# EAGLE design daughterboard (EAGLE 4.16)
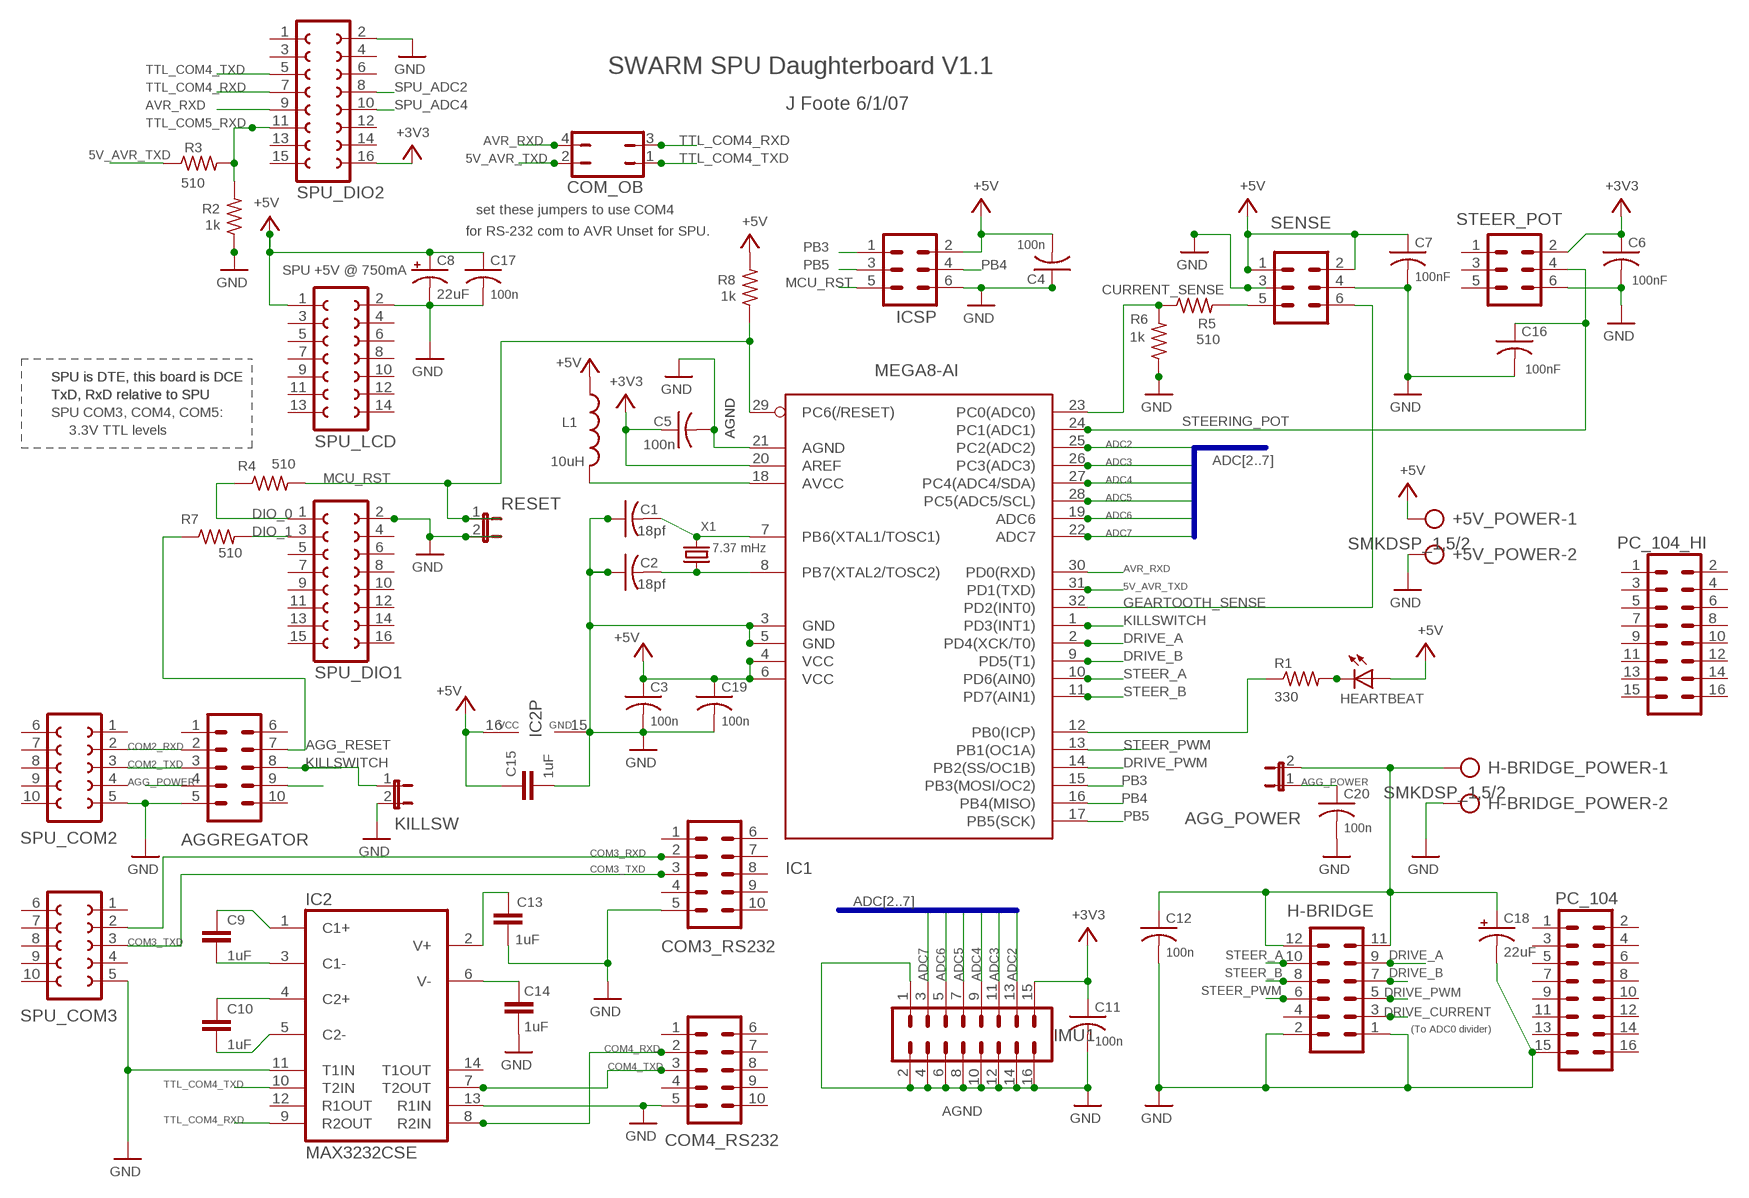
[diagram p0: schematic, sheet 1]

## Parts
+5V_POWER  SMKDSP_1,5/2  [SMKDSP_1,5/2]
AGG_POWER  JP1E  [JP1]
AGGREGATOR  COMHEADER-M  [MA05-2]
C1  18pf  C-USC1206  [C1206]
C2  18pf  C-USC1206  [C1206]
C3  100n  C-USC1206  [C1206]
C4  100n  C-USC1206  [C1206]
C5  100n  C-USC1206  [C1206]
C6  100nF  C-USC1206  [C1206]
C7  100nF  C-USC1206  [C1206]
C8  22uF  CPOL-USCT7343  [CT7343]
C9  1uF  C-EUC1206  [C1206]
C10  1uF  C-EUC1206  [C1206]
C11  100n  C-USC1206  [C1206]
C12  100n  C-USC1206  [C1206]
C13  1uF  C-EUC1206  [C1206]
C14  1uF  C-EUC1206  [C1206]
C15  1uF  C-EUC1206  [C1206]
C16  100nF  C-USC1206  [C1206]
C17  100n  C-USC1206  [C1206]
C18  22uF  CPOL-USCT7343  [CT7343]
C19  100n  C-USC1206  [C1206]
C20  100n  C-USC1206  [C1206]
COM3_RS232  COMHEADER-M  [MA05-2]
COM4_RS232  COMHEADER-M  [MA05-2]
COM_OB  JP2Q  [JP2Q]
H-BRIDGE  MA06-2  [MA06-2]
H-BRIDGE_POWER  SMKDSP_1,5/2  [SMKDSP_1,5/2]
HEARTBEAT  LEDSMT1206  [1206]
IC1  MEGA8-AI  [TQFP32-08]
IC2  MAX3232CSE  [SO16]
ICSP  MA03-2  [MA03-2]
IMU1  MA08-2  [MA08-2]
KILLSW  JP1E  [JP1]
L1  10uH  L-USL5038P  [L5038P]
PC_104  MA08-2  [MA08-2]
PC_104_HI  MA08-2  [MA08-2]
R1  330  R-US_M1206  [M1206]
R2  1k  R-US_M1206  [M1206]
R3  510  R-US_M1206  [M1206]
R4  510  R-US_M1206  [M1206]
R5  510  R-US_M1206  [M1206]
R6  1k  R-US_M1206  [M1206]
R7  510  R-US_M1206  [M1206]
R8  1k  R-US_M1206  [M1206]
RESET  JP1E  [JP1]
SENSE  MA03-2  [MA03-2]
SPU_COM2  COMHEADER  [FE05-2]
SPU_COM3  COMHEADER  [FE05-2]
SPU_DIO1  FE08-2  [FE08-2]
SPU_DIO2  FE08-2  [FE08-2]
SPU_LCD  FE07-2  [FE07-2]
STEER_POT  MA03-2  [MA03-2]
X1  7.37 mHz  CRYSTALHC49UP  [HC49UP]

## Nets
5V_AVR_TXD: COM_OB.2 IC1.31(PD1(TXD)) R3.1
+3V3 [GND]: C5.1 C6.1 C11.1 IC1.20(AREF) IMU1.15 SPU_DIO2.16 STEER_POT.2
+5V: +5V_POWER.1 C3.1 C4.2 C7.1 C8.+ C15.1 C17.1 C19.1 HEARTBEAT.A IC1.4(VCC) IC1.6(VCC) IC2.16(VCC) ICSP.2 L1.1 R8.2 SENSE.1 SENSE.2 SPU_LCD.1
ADC2: IC1.25(PC2(ADC2)) IMU1.13
ADC3: IC1.26(PC3(ADC3)) IMU1.11
ADC4: IC1.27(PC4(ADC4/SDA)) IMU1.9
ADC5: IC1.28(PC5(ADC5/SCL)) IMU1.7
ADC6: IC1.19(ADC6) IMU1.5
ADC7: IC1.22(ADC7) IMU1.3
AGG_POWER: AGG_POWER.1 AGGREGATOR.4 AGGREGATOR.9 C20.1
AGG_RESET: AGGREGATOR.7 R7.1
AVR_RXD: COM_OB.4 IC1.30(PD0(RXD)) SPU_DIO2.9
COM2_RXD: AGGREGATOR.2 SPU_COM2.2
COM2_TXD: AGGREGATOR.3 SPU_COM2.3
COM3_RXD: COM3_RS232.2 SPU_COM3.2
COM3_TXD: COM3_RS232.3 SPU_COM3.3
COM4_RXD: COM4_RS232.2 IC2.8(R2IN)
COM4_TXD: COM4_RS232.3 IC2.7(T2OUT)
CURRENT_SENSE: IC1.23(PC0(ADC0)) R5.1 R6.2
DIO_0: R4.1 SPU_DIO1.1
DIO_1: R7.2 SPU_DIO1.3
DRIVE_A: H-BRIDGE.9 IC1.2(PD4(XCK/T0))
DRIVE_B: H-BRIDGE.7 IC1.9(PD5(T1))
DRIVE_CURRENT: H-BRIDGE.3 R5.2 SENSE.5
DRIVE_PWM: H-BRIDGE.5 IC1.14(PB2(SS/OC1B))
GEARTOOTH_SENSE: IC1.32(PD2(INT0)) SENSE.6
GND [GND]: +5V_POWER.2 AGGREGATOR.5 C1.1 C2.1 C3.2 C4.1 C5.2 C6.2 C7.2 C8.- C11.2 C12.2 C13.2 C14.2 C15.2 C16.2 C17.2 C18.- C19.2 C20.2 COM3_RS232.5 COM4_RS232.5 H-BRIDGE.1 H-BRIDGE.2 H-BRIDGE_POWER.2 IC1.3(GND) IC1.5(GND) IC1.21(AGND) IC2.11(T1IN) IC2.13(R1IN) IC2.15(GND) ICSP.6 IMU1.1 IMU1.2 IMU1.4 IMU1.6 IMU1.8 IMU1.10 IMU1.12 IMU1.14 IMU1.16 KILLSW.2 PC_104.15 R2.1 R6.1 RESET.2 SENSE.3 SENSE.4 SPU_COM2.5 SPU_COM3.5 SPU_DIO1.2 SPU_DIO2.2 SPU_LCD.2 STEER_POT.6
H-BRIDGE_POWER: AGG_POWER.2 C12.1 C18.+ H-BRIDGE.11 H-BRIDGE.12 H-BRIDGE_POWER.1
KILLSWITCH: AGGREGATOR.8 IC1.1(PD3(INT1)) KILLSW.1
MCU_RST: IC1.29(PC6(/RESET)) ICSP.5 R4.2 R8.1 RESET.1
N$1: IC1.12(PB0(ICP)) R1.1
N$3: HEARTBEAT.C R1.2
N$4 [GND]: C1.2 IC1.7(PB6(XTAL1/TOSC1)) X1.2
N$5: IC1.18(AVCC) L1.2
N$7: C14.1 IC2.6(V-)
N$9 [GND]: C2.2 IC1.8(PB7(XTAL2/TOSC2)) X1.1
N$10: C10.1 IC2.4(C2+)
N$11: C13.1 IC2.2(V+)
N$12: C10.2 IC2.5(C2-)
N$13: C9.2 IC2.3(C1-)
N$15: C9.1 IC2.1(C1+)
PB3: IC1.15(PB3(MOSI/OC2)) ICSP.1
PB4: IC1.16(PB4(MISO)) ICSP.4
PB5: IC1.17(PB5(SCK)) ICSP.3
SPU_ADC2: SPU_DIO2.8
SPU_ADC4: SPU_DIO2.10
STEER_A [GND]: H-BRIDGE.10 IC1.10(PD6(AIN0))
STEER_B: H-BRIDGE.8 IC1.11(PD7(AIN1))
STEER_PWM: H-BRIDGE.6 IC1.13(PB1(OC1A))
STEERING_POT: C16.1 IC1.24(PC1(ADC1)) STEER_POT.4
TTL_COM4_RXD: COM_OB.3 IC2.9(R2OUT) SPU_DIO2.7
TTL_COM4_TXD: COM_OB.1 IC2.10(T2IN) SPU_DIO2.5
TTL_COM5_RXD: R2.2 R3.2 SPU_DIO2.11
Unconnected: AGGREGATOR.1 AGGREGATOR.6 AGGREGATOR.10 COM3_RS232.1 COM3_RS232.4 COM3_RS232.6 COM3_RS232.7 COM3_RS232.8 COM3_RS232.9 COM3_RS232.10 COM4_RS232.1 COM4_RS232.4 COM4_RS232.6 COM4_RS232.7 COM4_RS232.8 COM4_RS232.9 COM4_RS232.10 H-BRIDGE.4 IC2.12(R1OUT) IC2.14(T1OUT) PC_104.1 PC_104.2 PC_104.3 PC_104.4 PC_104.5 PC_104.6 PC_104.7 PC_104.8 PC_104.9 PC_104.10 PC_104.11 PC_104.12 PC_104.13 PC_104.14 PC_104.16 PC_104_HI.1 PC_104_HI.2 PC_104_HI.3 PC_104_HI.4 PC_104_HI.5 PC_104_HI.6 PC_104_HI.7 PC_104_HI.8 PC_104_HI.9 PC_104_HI.10 PC_104_HI.11 PC_104_HI.12 PC_104_HI.13 PC_104_HI.14 PC_104_HI.15 PC_104_HI.16 SPU_COM2.1 SPU_COM2.4 SPU_COM2.6 SPU_COM2.7 SPU_COM2.8 SPU_COM2.9 SPU_COM2.10 SPU_COM3.1 SPU_COM3.4 SPU_COM3.6 SPU_COM3.7 SPU_COM3.8 SPU_COM3.9 SPU_COM3.10 SPU_DIO1.4 SPU_DIO1.5 SPU_DIO1.6 SPU_DIO1.7 SPU_DIO1.8 SPU_DIO1.9 SPU_DIO1.10 SPU_DIO1.11 SPU_DIO1.12 SPU_DIO1.13 SPU_DIO1.14 SPU_DIO1.15 SPU_DIO1.16 SPU_DIO2.1 SPU_DIO2.3 SPU_DIO2.4 SPU_DIO2.6 SPU_DIO2.12 SPU_DIO2.13 SPU_DIO2.14 SPU_DIO2.15 SPU_LCD.3 SPU_LCD.4 SPU_LCD.5 SPU_LCD.6 SPU_LCD.7 SPU_LCD.8 SPU_LCD.9 SPU_LCD.10 SPU_LCD.11 SPU_LCD.12 SPU_LCD.13 SPU_LCD.14 STEER_POT.1 STEER_POT.3 STEER_POT.5

## Buses
ADC[2..7]

## Notes on the sheet
- SWARM SPU Daughterboard V1.1
- J Foote 6/1/07
- set these jumpers to use COM4
- for RS-232 com to AVR Unset for SPU.
- SPU +5V @ 750mA
- SPU is DTE, this board is DCE | SPU is DTE, this board is DCE
- TxD, RxD relative to SPU | TxD, RxD relative to SPU | AGND | AGND
- SPU COM3, COM4, COM5:
- 3.3V TTL levels
- (To ADC0 divider)
- AGND

## Library data of the parts
+5V_POWER H-BRIDGE_POWER = con-phoenix-smkdsp:SMKDSP_1,5/2: Printklemme, Nennstrom: 17,5 A, Bemessungsspannung: 250 V, Raster: 5,0 mm Source: http://eshop.phoenixcontact.de .. 1733415.pdf
AGG_POWER KILLSW RESET = jumper:JP1E: JUMPER
AGGREGATOR COM3_RS232 COM4_RS232 = foote:COMHEADER-M
C1-C7 C11 C12 C16 C17 C19 C20 = rcl:C-US: CAPACITOR, American symbol
C8 C18 = rcl:CPOL-US: POLARIZED CAPACITOR, American symbol
C9 C10 C13-C15 = rcl:C-EU: CAPACITOR, European symbol
COM_OB = jumper:JP2Q: JUMPER
H-BRIDGE = con-lstb:MA06-2: PIN HEADER
HEARTBEAT = led:LED: LED OSRAM: - CHIPLED LG R971, LG N971, LY N971, LG Q971, LY Q971, LO R971, LY R971 LH N974, LH R974 LS Q976, LO Q976, LY Q976 LO Q996 - Hyper CHIPLED LW Q18S LB Q993, LB Q99A, LB R99A - SideLED LS A670, LO A670, LY A670, LG A670, LP A670 LB A673, LV A673, LT A673, LW A673 LH A674 LY A675 LS A676, LA A676, LO A676, LY A676, LW A676 LS A679, LY A679, LG A679 - Hyper Micro SIDELED® LS Y876, LA Y876, LO Y876, LY Y876 LT Y87S - SmartLED LW L88C, LW L88S LB L89C, LB L89S, LG L890 LS L89K, LO L89K, LY L89K LS L896, LA L896, LO L896, LY L896 - TOPLED LS T670, LO T670, LY T670, LG T670, LP T670 LSG T670, LSP T670, LSY T670, LOP T670, LYG T670 LG T671, LOG T671, LSG T671 LB T673, LV T673, LT T673, LW T673 LH T674 LS T676, LA T676, LO T676, LY T676, LB T676, LH T676, LSB T676, LW T676 LB T67C, LV T67C, LT T67C, LS T67K, LO T67K, LY T67K, LW E67C LS E67B, LA E67B, LO E67B, LY E67B, LB E67C, LV E67C, LT E67C LW T67C LS T679, LY T679, LG T679 LS T770, LO T770, LY T770, LG T770, LP T770 LB T773, LV T773, LT T773, LW T773 LH T774 LS E675, LA E675, LY E675, LS T675 LS T776, LA T776, LO T776, LY T776, LB T776 LHGB T686 LT T68C, LB T68C - Hyper Mini TOPLED® LB M676 - Mini TOPLED Santana® LG M470 LS M47K, LO M47K, LY M47K Source: http://www.osram.convergy.de - LUMILED® LXK2-PW12-R00, LXK2-PW12-S00, LXK2-PW14-U00, LXK2-PW14-V00 LXK2-PM12-R00, LXK2-PM12-S00, LXK2-PM14-U00 LXK2-PE12-Q00, LXK2-PE12-R00, LXK2-PE12-S00, LXK2-PE14-T00, LXK2-PE14-U00 LXK2-PB12-K00, LXK2-PB12-L00, LXK2-PB12-M00, LXK2-PB14-N00, LXK2-PB14-P00, LXK2-PB14-Q00 LXK2-PR12-L00, LXK2-PR12-M00, LXK2-PR14-Q00, LXK2-PR14-R00 LXK2-PD12-Q00, LXK2-PD12-R00, LXK2-PD12-S00 LXK2-PH12-R00, LXK2-PH12-S00 LXK2-PL12-P00, LXK2-PL12-Q00, LXK2-PL12-R00 Source: www.luxeon.com
IC1 = atmel:MEGA8: MICROCONTROLLER 8 Kbytes FLASH 1 kbytes SRAM 512 bytes EEPROM USART 6-channel 10 bit ADC 2-channel 8 bit ADC Source: avr.lbr
IC2 = maxim:MAX3232*: True RS-232 Transceivers 3.0V to 5.5V, Low-Power up to 1Mbps, Using Four 0.1µF External Capacitors Source: http://pdfserv.maxim-ic.com/en/ds/MAX3222-MAX3241.pdf
ICSP SENSE STEER_POT = con-lstb:MA03-2: PIN HEADER
IMU1 PC_104 PC_104_HI = con-lstb:MA08-2: PIN HEADER
L1 = rcl:L-US: INDUCTOR, American symbol
R1-R8 = rcl:R-US_: RESISTOR, American symbol
SPU_COM2 SPU_COM3 = foote:COMHEADER
SPU_DIO1 SPU_DIO2 = con-lsta:FE08-2: FEMALE HEADER
SPU_LCD = con-lsta:FE07-2: FEMALE HEADER
X1 = crystal:CRYSTAL: CRYSTAL

## Board
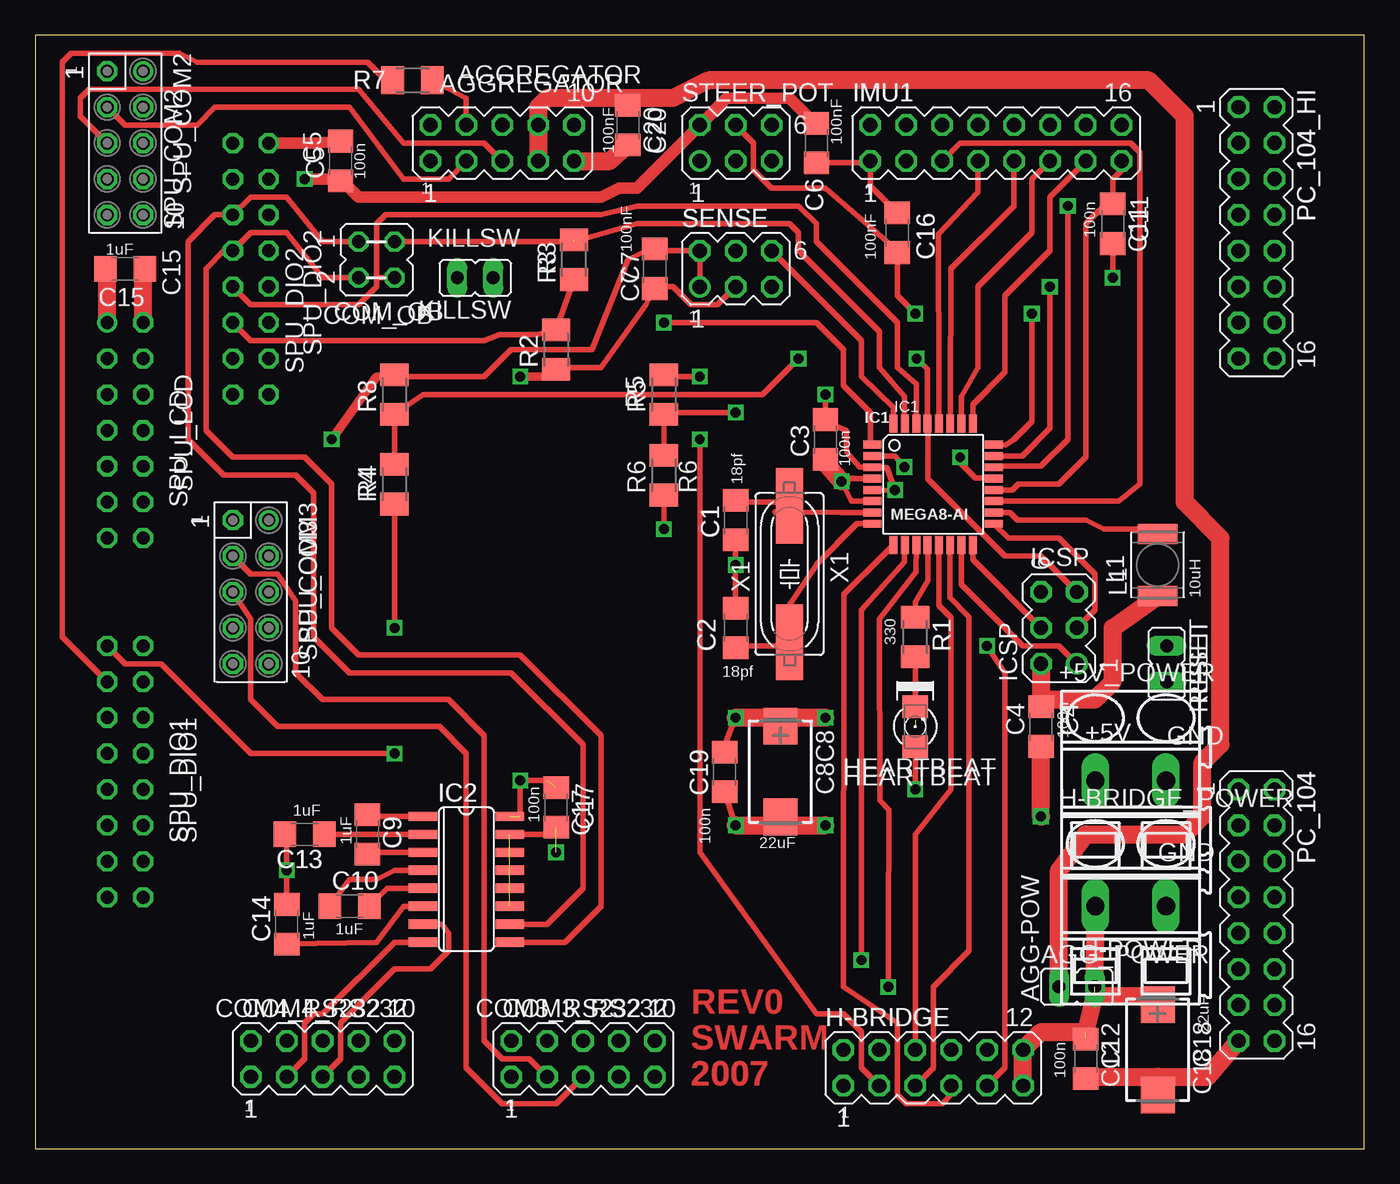
[diagram p1: board, top side]
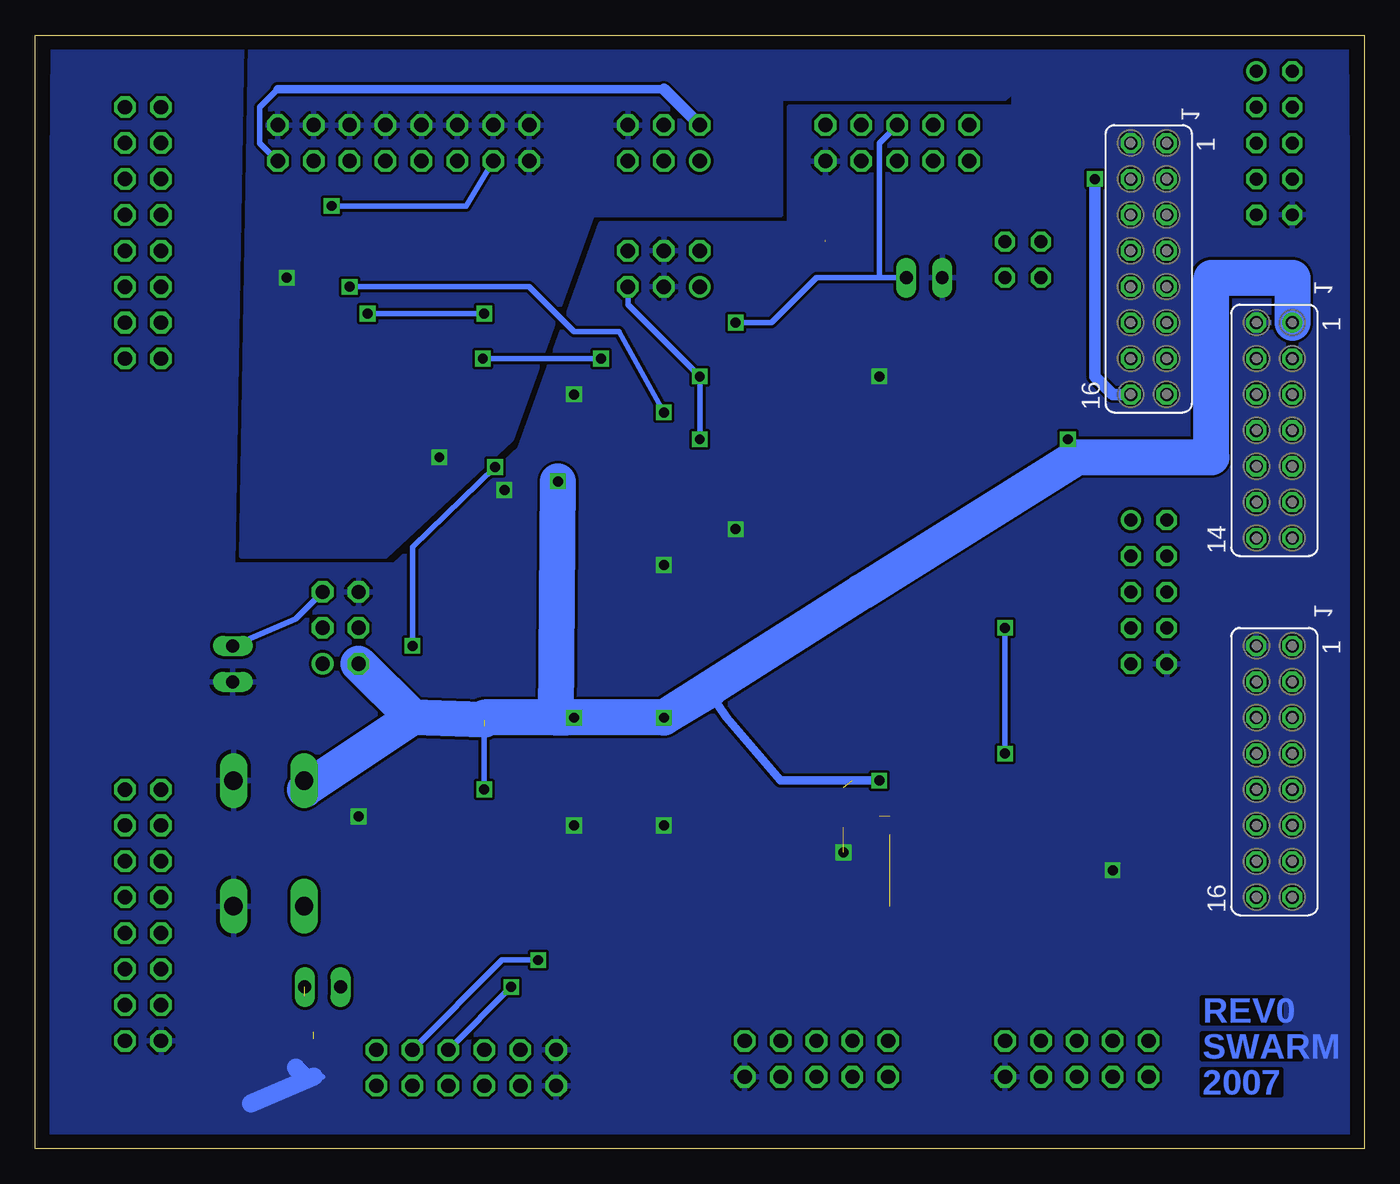
[diagram p2: board, bottom side, seen from below]

Size 93.98 x 78.74 mm. Coordinates in mm from the lower left corner, seen from the top.
Outline: 0,0 93.98,0 93.98,78.74 0,78.74 0,0
Copper layers (1*16): Top 0.035mm / dielectric 1.5mm / Bottom 0.035mm
Design rules "default": minimum track width 10mil, minimum drill 24mil, track to track 8mil, track to pad 8mil, pad to pad 8mil, via to via 8mil, smd to smd 8mil, copper to edge 40mil, drill to drill 8mil, minimum pad ring 10mil, minimum via ring 8mil, stop-mask expansion 4mil, vias tented up to drill 0mil, thermal gap 10mil

### Footprints (pad centres in the part's own frame; a part is rotated, then mirrored left to right if it is on the bottom)
SMKDSP_1,5/2 = drill 1.3 pad 1.676 long: 1 -2.5,0; 2 2.5,0
JP1 = drill 0.914 long: 1 0,-1.27; 2 0,1.27
MA05-2 = drill 1.016 octagon: 1 -5.08,-1.27; 2 -2.54,-1.27; 3 0,-1.27; 4 2.54,-1.27; 5 5.08,-1.27; 6 -5.08,1.27; 7 -2.54,1.27; 8 0,1.27; 9 2.54,1.27; 10 5.08,1.27
C1206 = smd 1.6 x 1.8: 1 -1.4,0; 2 1.4,0
CT7343 = smd 2.6 x 2.4: + 3.2,0; - -3.2,0
JP2Q = drill 0.914 octagon: 1 -1.27,-1.27; 2 -1.27,1.27; 3 1.27,-1.27; 4 1.27,1.27
MA06-2 = drill 1.016 octagon: 1 -6.35,-1.27; 2 -6.35,1.27; 3 -3.81,-1.27; 4 -3.81,1.27; 5 -1.27,-1.27; 6 -1.27,1.27; 7 1.27,-1.27; 8 1.27,1.27; 9 3.81,-1.27; 10 3.81,1.27; 11 6.35,-1.27; 12 6.35,1.27
1206 = smd 1.6 x 1.803: A -1.422,0; C 1.422,0
TQFP32-08 = smd 1.27 x 0.559: 1 -4.293,2.8; 2 -4.293,2; 3 -4.293,1.2; 4 -4.293,0.4; 5 -4.293,-0.4; 6 -4.293,-1.2; 7 -4.293,-2; 8 -4.293,-2.8; 17 4.293,-2.8; 18 4.293,-2; 19 4.293,-1.2; 20 4.293,-0.4; 21 4.293,0.4; 22 4.293,1.2; 23 4.293,2; 24 4.293,2.8 | smd 0.559 x 1.27: 9 -2.8,-4.293; 10 -2,-4.293; 11 -1.2,-4.293; 12 -0.4,-4.293; 13 0.4,-4.293; 14 1.2,-4.293; 15 2,-4.293; 16 2.8,-4.293; 25 2.8,4.293; 26 2,4.293; 27 1.2,4.293; 28 0.4,4.293; 29 -0.4,4.293; 30 -1.2,4.293; 31 -2,4.293; 32 -2.8,4.293
SO16 = smd 0.66 x 2.032: 1 -4.445,-3.073; 2 -3.175,-3.073; 3 -1.905,-3.073; 4 -0.635,-3.073; 5 0.635,-3.073; 6 1.905,-3.073; 7 3.175,-3.073; 8 4.445,-3.073; 9 4.445,3.073; 10 3.175,3.073; 11 1.905,3.073; 12 0.635,3.073; 13 -0.635,3.073; 14 -1.905,3.073; 15 -3.175,3.073; 16 -4.445,3.073
MA03-2 = drill 1.016 round: 1 -2.54,-1.27 | drill 1.016 octagon: 2 -2.54,1.27; 3 0,-1.27; 4 0,1.27; 5 2.54,-1.27; 6 2.54,1.27
MA08-2 = drill 1.016 octagon: 1 -8.89,-1.27; 2 -8.89,1.27; 3 -6.35,-1.27; 4 -6.35,1.27; 5 -3.81,-1.27; 6 -3.81,1.27; 7 -1.27,-1.27; 8 -1.27,1.27; 9 1.27,-1.27; 10 1.27,1.27; 11 3.81,-1.27; 12 3.81,1.27; 13 6.35,-1.27; 14 6.35,1.27; 15 8.89,-1.27; 16 8.89,1.27
L5038P = smd 1.4 x 2.8: 1 -2.2,0; 2 2.2,0
M1206 = smd 1.6 x 2: 1 -1.4,0; 2 1.4,0
FE05-2 = drill 0.914 octagon: 1 -5.08,-1.27; 2 -2.54,-1.27; 3 0,-1.27; 4 2.54,-1.27; 5 5.08,-1.27; 7 -2.54,1.27; 8 0,1.27; 9 2.54,1.27; 10 5.08,1.27 | drill 0.914 round: 6 -5.08,1.27
FE08-2 = drill 0.914 octagon: 1 -8.89,1.27; 2 -8.89,-1.27; 3 -6.35,1.27; 4 -6.35,-1.27; 5 -3.81,1.27; 6 -3.81,-1.27; 7 -1.27,1.27; 8 -1.27,-1.27; 9 1.27,1.27; 10 1.27,-1.27; 11 3.81,1.27; 12 3.81,-1.27; 13 6.35,1.27; 14 6.35,-1.27; 15 8.89,1.27; 16 8.89,-1.27
FE07-2 = drill 0.914 round: 1 -7.62,1.27 | drill 0.914 octagon: 2 -7.62,-1.27; 3 -5.08,1.27; 4 -5.08,-1.27; 5 -2.54,1.27; 6 -2.54,-1.27; 7 0,1.27; 8 0,-1.27; 9 2.54,1.27; 10 2.54,-1.27; 11 5.08,1.27; 12 5.08,-1.27; 13 7.62,1.27; 14 7.62,-1.27
HC49UP = smd 5.334 x 1.93: 1 -4.826,0; 2 4.826,0

### Placement (x,y rotation side)
+5V_POWER  77.47,26.04 0 top
AGG_POWER  73.66,11.43 270 top
AGGREGATOR  33.02,71.12 0 top
C1  49.53,44.45 90 top
C2  49.53,36.83 270 top
C3  55.88,50.16 90 top
C4  71.12,29.84 90 top
C5  21.59,69.85 90 top
C6  55.24,71.12 270 top
C7  43.81,62.23 270 top
C8  52.7,26.67 90 top
C9  23.5,22.23 270 top
C10  22.23,17.14 0 top
C11  76.2,65.41 270 top
C12  74.3,6.35 270 top
C13  19.05,22.23 180 top
C14  17.78,15.88 90 top
C15  6.35,62.23 0 top
C16  60.96,64.77 90 top
C17  36.83,24.13 270 top
C18  79.38,6.99 90 top
C19  48.74,26.64 270 top
C20  41.91,72.39 270 top
COM3_RS232  38.73,6.35 0 top
COM4_RS232  20.32,6.35 0 top
COM_OB  24.13,62.87 270 top
H-BRIDGE  63.5,5.71 0 top
H-BRIDGE_POWER  77.47,17.14 0 top
HEARTBEAT  62.23,29.84 90 top
IC1  63.5,46.99 0 top
IC2  30.48,19.05 270 top
ICSP  72.39,36.83 90 top
IMU1  67.94,71.12 0 top
KILLSW  31.11,61.59 90 top
L1  79.38,41.27 90 top
PC_104  86.36,16.51 270 top
PC_104_HI  86.36,64.77 270 top
R1  62.23,36.2 270 top
R2  36.83,56.52 90 top
R3  38.1,62.87 270 top
R4  25.4,46.99 90 top
R5  44.45,53.34 90 top
R6  44.45,47.62 90 top
R7  26.67,75.56 180 top
R8  25.4,53.34 90 top
RESET  80.01,34.29 180 top
SENSE  49.53,62.23 0 top
SPU_COM2  6.35,71.12 270 top
SPU_COM3  15.24,39.37 270 top
SPU_DIO1  6.35,26.67 270 bottom
SPU_DIO2  15.24,62.23 270 bottom
SPU_LCD  6.35,50.8 270 bottom
STEER_POT  49.53,71.12 0 top
X1  53.34,40.64 90 top

### Tracks (layer width: path | path; a pad name or v marks a point on that pad's centre or on a via)
5V_AVR_TXD  (1 unrouted)
  Top 0.406: 38.73,64.77 R3.1 38.1,64.77 | IC1.31 61.47,51.33 61.47,53.19 59.69,55.24 59.69,57.78 53.98,63.5 53.98,64.77 53.34,65.41 42.55,65.41 38.1,64.14 COM_OB.2
+3V3  (via drill 0.7)
  Top 0.254: 76.2,67.31 C11.1
  Top 0.406: IC1.20 69.11,46.58 69.52,46.99 72.39,46.99 74.3,48.9 74.3,65.41 76.2,67.31 76.2,68.58 76.83,69.22 IMU1.15 | 55.24,72.39 C6.1 | C5.1 21.59,68.58
  Top 0.813: 55.24,72.39 53.34,74.3 48.9,74.3 STEER_POT.2 42.55,67.94 41.27,67.94 40.01,67.31 22.86,67.31 21.59,68.58 | C5.1 21.46,68.58 v19.05,68.58
  Bottom 0.406: 76.83,74.93 78.11,73.66 78.11,71.12 IMU1.15
  Bottom 0.61: 49.53,74.93 76.83,74.93
  Bottom 0.813: STEER_POT.2 49.53,74.93 | v19.05,68.58 19.05,54.61 17.78,53.34 SPU_DIO2.16
+5V  (via drill 0.7)  (3 unrouted)
  Top 0.254: 53.34,30.48 C8.+
  Top 0.406: IC1.6 57.73,45.8 v57.02,47.19 57.78,47.42 57.76,47.4 IC1.4 | 43.18,63.5 C7.1 | SENSE.1 SENSE.2 43.18,63.5 | C19.1 48.77,28.57 v49.53,30.48 | 34.29,23.5 v34.29,26.04 36.2,26.04 | 43.18,63.5 41.91,62.87 39.37,56.52 33.66,56.52 31.75,54.61 26.04,54.61 R8.2 | C4.2 71.25,31.11 | v62.23,25.4 HEARTBEAT.A 62.23,28.57
  Top 0.61: R8.2 25.4,54.61 24.13,54.61 v20.95,50.16
  Top 1.27: 71.12,31.75 C4.2 | C3.1 55.93,48.46 v57.02,47.19 | 52.7,29.21 C8.+ 52.7,30.48 | v49.53,30.48 53.34,30.48 v55.88,30.48 | L1.1 76.2,36.83 76.2,33.02 74.93,31.75 71.12,31.75 | ICSP.2 71.12,31.75 | C15.1 5.08,62.1 SPU_LCD.1
  Bottom 0.406: v62.23,25.4 62.23,29.84 | +5V_POWER.1 74.93,26 74.93,25.4
  Bottom 0.61: 20.32,48.9 v20.95,50.16 | v34.29,26.04 41.27,26.04 45.09,30.48 46.35,32.38
  Bottom 1.27: SPU_LCD.1 5.08,57.78
  Bottom 2.54: 67.31,30.48 ICSP.2 | 67.31,30.48 62.23,30.33 62.23,30.48 57.15,30.48 | 67.31,30.48 74.93,25.4 | 46.35,32.38 v49.53,30.48 | 57.15,30.48 56.52,30.48 | v49.53,30.48 57.15,30.48 | 57.15,30.48 v57.02,47.19 | v49.53,30.48 35.56,39.37 20.32,48.9 10.79,48.9 10.79,61.59 5.08,61.59 SPU_LCD.1
ADC2
  Top 0.406: IC1.25 66.29,52.25 66.32,52.63 68.58,54.91 68.58,60.33 71.75,63.5 71.75,67.31 IMU1.13
ADC3
  Top 0.406: IC1.26 65.51,52.45 65.51,53.19 66.67,55.24 66.67,60.96 70.48,64.77 70.48,68.58 IMU1.11
ADC4
  Top 0.406: IC1.27 64.72,52.68 64.77,62.23 69.22,66.67 IMU1.9
ADC5
  Top 0.406: IC1.28 63.91,52.91 63.91,53.75 63.88,64.69 66.67,67.64 IMU1.7
ADC6
  Top 0.406: IC1.19 76.63,45.8 78.11,46.99 78.11,70.48 77.47,71.12 65.41,71.12 IMU1.5
ADC7  (via drill 0.7)
  Top 0.406: IC1.22 67.86,48.26 71.12,48.26 73.03,50.16 v73.03,66.67
  Bottom 0.406: v73.03,66.67 63.5,66.67 IMU1.3
AGG_POWER
  Top 1.27: AGGREGATOR.9 AGGREGATOR.4 AGGREGATOR.9 | AGGREGATOR.9 35.56,73.66 36.2,74.3 41.91,74.3 | 41.91,74.3 45.09,74.3 47.62,75.56 78.74,75.56 81.28,73.03 81.28,45.72 83.82,43.18 83.82,28.57 82.55,27.3 82.55,23.5 81.28,22.23 74.3,22.23 72.39,19.68 AGG_POWER.1 | 41.91,74.3 C20.1
AGG_RESET
  Top 0.406: AGGREGATOR.7 30.48,74.3 R7.1
AVR_RXD
  Top 0.406: IC1.30 62.33,54.08 60.96,55.24 60.96,58.42 55.24,64.14 55.24,65.41 53.98,66.67 42.55,66.67 40.01,66.04 24.77,66.04 24.13,65.41 24.13,61.59 | 24.13,61.59 COM_OB.4 | 24.13,61.59 24.13,60.96 22.86,59.69 15.24,59.69 SPU_DIO2.9
COM2_RXD
  Top 0.406: SPU_COM2.2 6.35,72.39 11.43,72.39 12.7,73.66 22.23,73.66 26.04,68.58 29.21,68.58 AGGREGATOR.2
COM2_TXD
  Top 0.406: AGGREGATOR.3 31.75,71.12 26.04,71.12 22.86,74.93 3.81,74.93 3.17,74.3 3.17,73.03 SPU_COM2.3
COM3_RXD
  Top 0.406: COM3_RS232.2 34.92,6.35 33.02,6.35 31.75,7.62 31.75,29.21 29.21,31.75 20.32,31.75 18.41,33.66 18.41,38.73 17.14,40.64 15.24,40.64 SPU_COM3.2
COM3_TXD
  Top 0.406: COM3_RS232.3 36.83,3.17 33.02,3.17 30.48,5.71 30.48,27.94 28.57,29.84 17.14,29.84 15.24,31.75 15.24,37.47 SPU_COM3.3
COM4_RXD
  Top 0.406: IC2.8 25.4,14.61 20.32,9.53 19.68,9.53 19.05,8.89 19.05,6.35 COM4_RS232.2
COM4_TXD
  Top 0.406: IC2.7 28.75,15.88 29.21,15.24 29.21,13.97 27.94,12.7 25.4,12.7 21.59,8.89 21.59,6.35 COM4_RS232.3
CURRENT_SENSE  (via drill 0.7)
  Top 0.254: R6.2 44.45,48.9 43.81,48.9
  Top 0.406: IC1.23 69.8,49 71.75,50.95 v71.75,60.96 | v49.53,52.07 43.81,52.07 R5.1 R6.2 43.81,48.9
  Bottom 0.406: v71.75,60.96 59.05,60.96 55.88,57.78 52.7,57.78 v49.53,52.07
DIO_0  (via drill 0.7)
  Top 0.406: SPU_DIO1.1 6.35,34.29 8.89,34.29 15.24,27.94 v25.4,27.94 | 25.4,45.72 R4.1 v25.4,36.83
  Bottom 0.406: v25.4,27.94 v25.4,36.83
DIO_1
  Top 0.406: R7.2 24.77,75.56 23.5,76.83 11.43,76.83 10.16,77.47 2.54,77.47 1.91,76.83 1.91,36.2 SPU_DIO1.3
DRIVE_A  (via drill 0.7)
  Top 0.406: 60.22,48.97 IC1.2 | v61.47,48.21 60.78,48.97 60.22,48.97 | 60.22,48.97 60.12,48.97 | H-BRIDGE.9 68.58,5.71 68.58,33.66 v67.31,35.56
  Bottom 0.406: v61.47,48.21 67.31,42.55 v67.31,35.56
DRIVE_B
  Top 0.406: H-BRIDGE.7 64.77,3.81 64.14,3.17 61.59,3.17 60.96,3.81 60.96,8.89 57.15,11.43 57.17,39.24 59.91,41.91 IC1.9
DRIVE_CURRENT  (via drill 0.7)
  Top 0.406: H-BRIDGE.3 58.42,5.71 58.42,8.26 57.15,9.53 55.24,9.53 46.99,20.95 v46.99,50.16 | 43.81,54.61 R5.2 44.45,54.61 v46.99,54.61
  Bottom 0.406: SENSE.5 52.07,59.69 v46.99,54.61 v46.99,50.16
DRIVE_PWM
  Top 0.406: IC1.14 64.67,42.67 64.67,38.99 66.04,37.62 66.04,13.97 63.5,11.43 63.5,5.71 H-BRIDGE.5
GEARTOOTH_SENSE
  Top 0.406: IC1.32 60.68,52.4 58.42,54.61 58.42,57.15 SENSE.6
GND  (via drill 0.7)  (4 unrouted)
  Top 0.406: v76.2,61.59 C11.2 | C2.1 v49.53,41.27 C1.1 | IC1.5 60.81,46.56 60.88,46.56 v60.81,46.58 60.22,48.16 IC1.3 58.27,48.19 57.4,49.22 57.38,49.74 57.38,50.8 55.88,51.44 | IC1.21 67.76,47.42 66.5,47.42 65.41,48.51 v65.41,48.9 | 55.24,69.85 C6.2 58.92,69.72 IMU1.1 59.05,68.08 C16.2 | SENSE.3 48.26,59.69 46.35,59.69 45.09,60.96 43.81,60.96 | 43.81,60.96 43.18,60.96 C7.2 43.81,60.96 | C3.2 56.52,51.44 55.88,51.44 | 55.88,51.44 v55.88,53.34 | 17.78,17.14 C14.2 v17.78,19.68 17.78,22.09 C13.2 | C19.2 v49.53,22.86 | IC2.15 36.83,22.23 | R2.1 36.96,55.24 40.01,55.24 43.18,59.69 43.81,60.96 | R6.1 44.45,45.97 v44.45,43.81
  Top 0.61: v34.29,54.61 36.83,54.61 36.83,55.24
  Top 0.813: C5.2 19.82,71.12 SPU_DIO2.2
  Top 1.27: v71.12,23.5 C4.1 | C8.- 52.47,23.23 arc-45 51.57,22.86 | v49.53,22.86 51.57,22.86 | 51.57,22.86 v55.88,22.86 | C15.2 7.62,62.1 SPU_LCD.2 | 84.96,7.49 PC_104.15 82.92,5.08 79.38,5.08 | C12.2 74.3,5.08 79.38,5.08 | 79.38,5.08 C18.- | C20.2 40.64,69.85 AGGREGATOR.5
  Bottom 0.406: 73.66,5.08 74.3,5.08 74.93,5.08
  Bottom 1.27: 74.93,5.08 75.56,5.71 | 74.3,5.08 78.74,3.17
  other vias: 36.83,20.95
  pour Bottom: 93.34,0.64 0.64,0.64 1.27,78.11 24.77,77.47 24.77,73.66 40.64,73.66 40.64,65.41 53.98,65.41 59.69,49.53 68.58,41.27 80.01,41.27 79.38,78.11 92.71,78.11
  pour Bottom: 20.95,78.11 78.74,78.11 79.38,41.91 69.22,41.91 60.33,50.16 54.61,66.04 41.27,66.04 41.27,74.3 25.4,74.3
H-BRIDGE_POWER  (2 unrouted)
  Top 0.406: 78.74,10.79 C18.+
  Top 1.27: C18.+ 79.33,10.79 74.93,10.79 | 74.93,10.79 H-BRIDGE_POWER.1 | C18.+ 78.08,10.79 74.93,10.79 | 74.93,10.79 74.3,8.26 71.12,8.26 H-BRIDGE.12 H-BRIDGE.11
KILLSWITCH  (via drill 0.7)
  Top 0.406: IC1.1 59.05,49.94 59.05,52.07 57.15,53.98 57.15,56.52 55.24,58.42 v44.45,58.42
  Bottom 0.406: AGGREGATOR.8 34.29,71.12 34.29,61.59 | v44.45,58.42 41.91,58.42 38.73,61.59 34.29,61.59 | KILLSW.1 34.29,61.59
MCU_RST  (via drill 0.7)
  Top 0.406: ICSP.5 71.12,41.91 68.58,41.91 63.12,47.37 63.12,50.62 63.1,50.63 IC1.29 63.09,55.12 v62.33,55.88 | v53.98,55.88 51.44,53.34 27.43,53.34 R8.1 | R8.1 25.4,52.07 | R4.2 R8.1
  Bottom 0.406: v53.98,55.88 v62.33,55.88 | RESET.1 75.56,37.47 ICSP.5
N$1
  Top 0.406: IC1.12 63.12,42.68 63.12,40.18 62.23,38.66 R1.1 62.23,37.47
N$3
  Top 0.406: HEARTBEAT.C R1.2
N$4
  Top 0.406: IC1.7 57.02,44.98 52.3,45.01 X1.2 52.7,45.72 49.02,45.72 C1.2
N$5
  Top 0.254: 78.74,43.81 L1.2
  Top 0.406: IC1.18 68.91,44.98 69.44,44.45 74.3,44.45 75.56,43.81 78.74,43.81
N$7
  Top 0.406: C14.1 24.13,14.61 26.04,17.14 IC2.6
N$9
  Top 0.406: C2.2 49.02,35.56 52.7,35.56 X1.1 53.09,38.1 55.24,41.27 55.24,41.33 58.12,44.2 IC1.8
N$10
  Top 0.406: IC2.4 25.4,19.68 24.13,19.05 22.23,19.05 C10.1
N$11
  Top 0.406: 20.32,22.23 C13.1 IC2.2
N$12
  Top 0.406: C10.2 24.89,18.41 IC2.5 27.94,18.41
N$13
  Top 0.406: C9.2 23.5,20.95 IC2.3
N$15
  Top 0.406: C9.1 23.5,23.5 IC2.1
PB3
  Top 0.406: IC1.15 65.5,39.91 69.85,35.56 72.39,35.56 ICSP.1
PB4
  Top 0.406: IC1.16 66.3,41.65 ICSP.4
PB5
  Top 0.406: ICSP.3 74.93,38.1 74.93,40.64 72.39,43.18 68.8,43.18 IC1.17
STEER_A  (via drill 0.7)
  Top 0.406: IC1.10 61.47,42.66 61.47,41.48 58.42,38.1 v58.42,13.34
  Bottom 0.406: v58.42,13.34 60.96,13.34 H-BRIDGE.10
STEER_B  (via drill 0.7)
  Top 0.406: IC1.11 62.28,40.77 59.69,37.47 59.69,37.29 59.74,24.64 60.38,23.95 60.33,15.24 v60.33,11.43
  Bottom 0.406: H-BRIDGE.8 v60.33,11.43
STEER_PWM
  Top 0.406: IC1.13 63.91,38.43 64.77,37.57 64.77,25.4 62.23,22.23 H-BRIDGE.6
STEERING_POT  (via drill 0.7)
  Top 0.406: STEER_POT.4 50.8,71.12 50.8,69.22 52.07,67.94 55.88,67.94 60.96,63.5 C16.1 60.96,60.33 v62.23,59.05 | IC1.24 68.6,49.76 69.22,50.16 70.48,51.44 v70.48,59.05
  Bottom 0.406: v70.48,59.05 v62.23,59.05
TTL_COM4_RXD
  Top 0.406: IC2.9 37.47,14.61 40.01,17.14 40.01,29.21 34.29,34.92 22.86,34.92 20.95,36.83 20.95,46.99 19.05,48.9 13.97,48.9 12.06,50.8 12.06,62.23 13.34,63.5 SPU_DIO2.7 15.24,64.77 17.78,64.77 20.32,61.59 COM_OB.3
TTL_COM4_TXD
  Top 0.406: IC2.10 36.2,15.88 38.73,18.41 38.73,28.57 33.66,33.66 22.23,33.66 19.68,36.2 19.68,46.35 18.41,47.62 13.34,47.62 10.79,50.16 10.79,64.14 12.7,66.04 SPU_DIO2.5 15.24,67.31 17.78,67.31 20.32,64.14 COM_OB.1
TTL_COM5_RXD
  Top 0.406: R2.2 36.83,57.78 | R2.2 R3.2 | R2.2 35.49,57.56 32.82,57.56 31.75,57.15 15.24,57.15 SPU_DIO2.11

### Text on the board
Top: REV0 | SWARM | 2007 | 2007
Bottom: REV0 | SWARM | 2007
_tsilk: 1 | R7 | SPU_COM2 | AGGREGATOR | PC_104_HI | 100nF | C20 | STEER_POT | 100nF | IMU1 | C5 | 100n | C6 | 1 | 1 | 100nF | 1 | 100n | C11 | SPU_DIO2 | KILLSW | SENSE | R3 | 1uF | 100nF | C16 | C7 | C15 | COM_OB | 1 | SPU_LCD | R2 | R8 | R5 | IC1 | C3 | 100n | 18pf | R4 | R6 | 1 | SPU_COM3 | MEGA8-AI | C1 | ICSP | X1 | L1 | 10uH | 330 | C2 | R1 | RESET | 1 | 18pf | SPU_DIO1 | C4 | 100n | +5V | GND | C19 | HEARTBEAT | PC_104 | 100n | C17 | IC2 | C8 | 1uF | 100n | 1uF | C9 | C13 | 22uF | GND | C10 | C14 | 1uF | 1uF | H-POWER | 22uF | AGG-POW | COM4_RS232 | COM3_RS232 | H-BRIDGE | C12 | 100n | C18 | 1 | 1 | 1
_bsilk: 1 | 1 | 1